# EAGLE design dmx2uart (EAGLE 6.6.0)
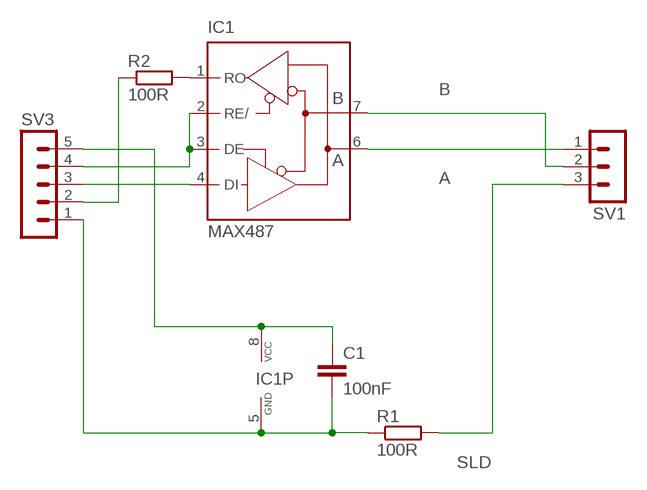
[diagram p0: schematic, sheet 1]

## Parts
C1  100nF  C-EU075-032X103  [C075-032X103]
IC1  MAX487  MAX481CPA  [DIL08]
R1  100R  R-EU_0207/7  [0207/7]
R2  100R  R-EU_0207/10  [0207/10]
SV1  MA03-1  [MA03-1]
SV3  MA05-1  [MA05-1]

## Nets
A: IC1.6(A) SV1.1
B: IC1.7(B) SV1.2
N$1: C1.2 IC1.5(GND) R1.1 SV3.1
N$2: C1.1 IC1.8(VCC) SV3.5
N$3: IC1.1(RO) R2.2
N$4: R2.1 SV3.2
N$5: IC1.2(RE/) IC1.3(DE) SV3.4
N$6: IC1.4(DI) SV3.3
SLD: R1.2 SV1.3

## Library data of the parts
C1 = rcl:C-EU: CAPACITOR, European symbol
IC1 = maxim:MAX481CPA: RS485 TRANSEIVER; MPN: MAX481CPA+; OC_FARNELL: unknown; OC_NEWARK: 99K3445
R1 = rcl:R-EU_: RESISTOR, European symbol
R2 = resistor:R-EU_: RESISTOR, European symbol
SV1 = con-lstb:MA03-1: PIN HEADER; OC_FARNELL: unknown; OC_NEWARK: unknown
SV3 = con-lstb:MA05-1: PIN HEADER; OC_FARNELL: unknown; OC_NEWARK: unknown

## Board
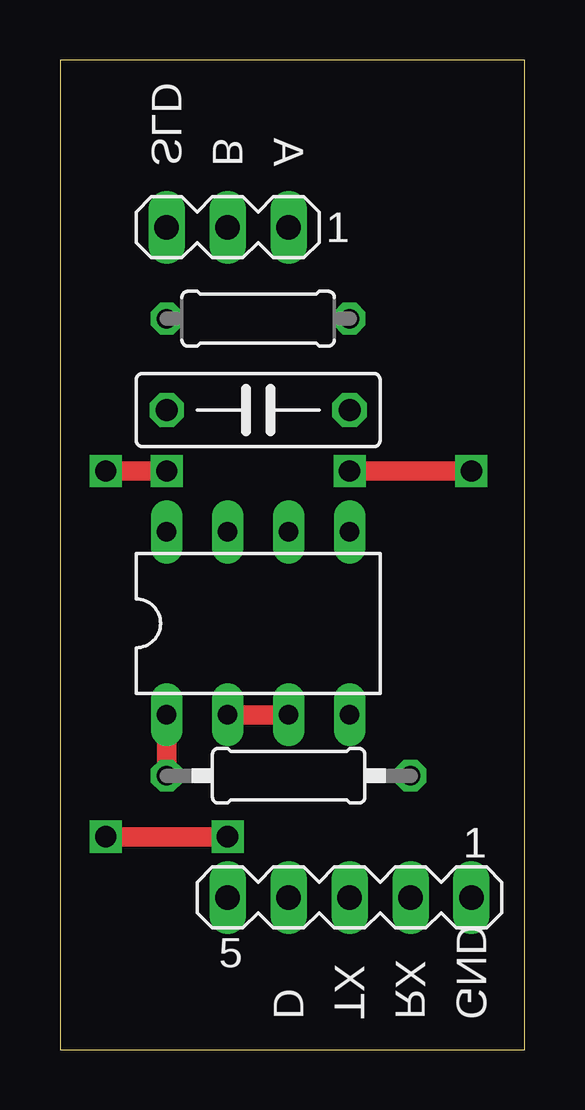
[diagram p1: board, top side]
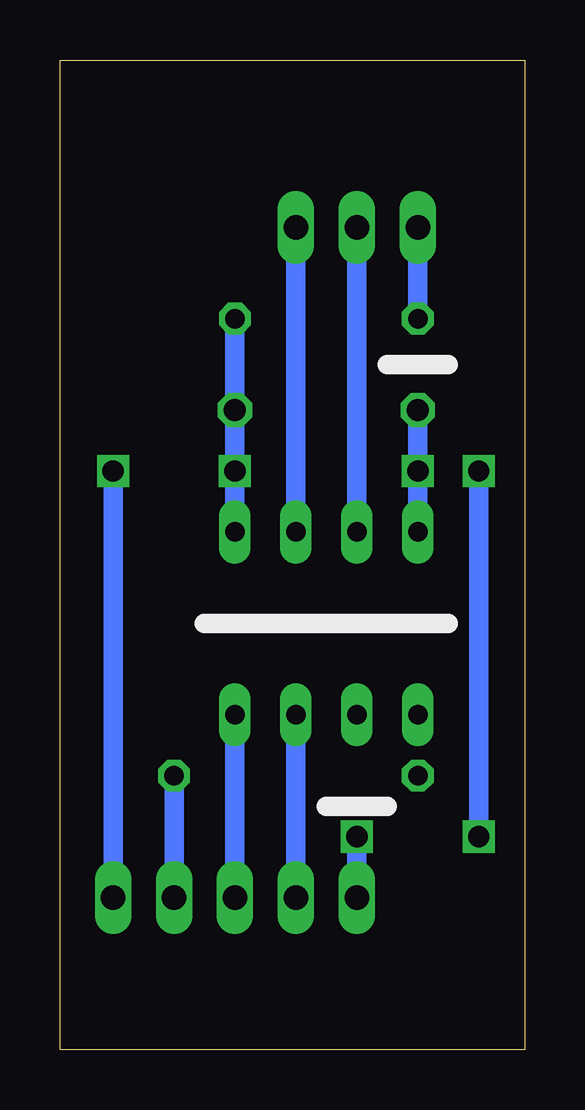
[diagram p2: board, bottom side, seen from below]

Size 19.36 x 41.27 mm. Coordinates in mm from the lower left corner, seen from the top.
Outline: 0,0 19.36,0 19.36,41.27 0,41.27 0,0
Copper layers (1*16): Top 0.035mm / dielectric 1.5mm / Bottom 0.035mm
Design rules "default": minimum track width 10mil, minimum drill 24mil, track to track 8mil, track to pad 8mil, pad to pad 8mil, via to via 8mil, smd to smd 8mil, copper to edge 40mil, drill to drill 8mil, minimum pad ring 10mil, minimum via ring 8mil, stop-mask expansion 4mil, vias tented up to drill 0mil, thermal gap 10mil

### Footprints (pad centres in the part's own frame; a part is rotated, then mirrored left to right if it is on the bottom)
C075-032X103 = drill 0.914 octagon: 1 -3.81,0; 2 3.81,0
DIL08 = drill 0.813 long: 1 -3.81,-3.81; 2 -1.27,-3.81; 3 1.27,-3.81; 4 3.81,-3.81; 5 3.81,3.81; 6 1.27,3.81; 7 -1.27,3.81; 8 -3.81,3.81
0207/7 = drill 0.813 octagon: 1 -3.81,0; 2 3.81,0
0207/10 = drill 0.813 octagon: 1 -5.08,0; 2 5.08,0
MA03-1 = drill 1.016 long: 1 -2.54,0; 2 0,0; 3 2.54,0
MA05-1 = drill 1.016 long: 1 -5.08,0; 2 -2.54,0; 3 0,0; 4 2.54,0; 5 5.08,0

### Placement (x,y rotation side)
C1  8.26,26.67 0 top
IC1  8.26,17.78 0 top
R1  8.26,30.48 180 top
R2  9.53,11.43 180 top
SV1  6.99,34.29 180 top
SV3  12.07,6.35 180 top

### Tracks (layer width: path | path; a pad name or v marks a point on that pad's centre or on a via)
A
  Bottom 0.813: IC1.6 SV1.1
B
  Bottom 0.813: IC1.7 SV1.2
N$1  (via drill 0.89)
  Top 0.813: v17.15,24.13 v12.07,24.13
  Bottom 0.813: IC1.5 C1.2 R1.1 v12.07,24.13 | SV3.1 v17.15,24.13
N$2  (via drill 0.89)
  Top 0.813: v6.99,8.89 v1.91,8.89 | v1.91,24.13 v4.45,24.13
  Bottom 0.813: C1.1 v4.45,24.13 IC1.8 | SV3.5 v6.99,8.89 | v1.91,8.89 v1.91,24.13
N$3
  Top 0.813: R2.2 IC1.1
N$4
  Bottom 0.813: SV3.2 R2.1
N$5
  Top 0.813: IC1.2 IC1.3
  Bottom 0.813: SV3.4 IC1.3
N$6
  Bottom 0.813: SV3.3 IC1.4
SLD
  Bottom 0.813: R1.2 SV1.3

### Text on the board
tPlace: SLD | B | A | D | TX | RX | GND